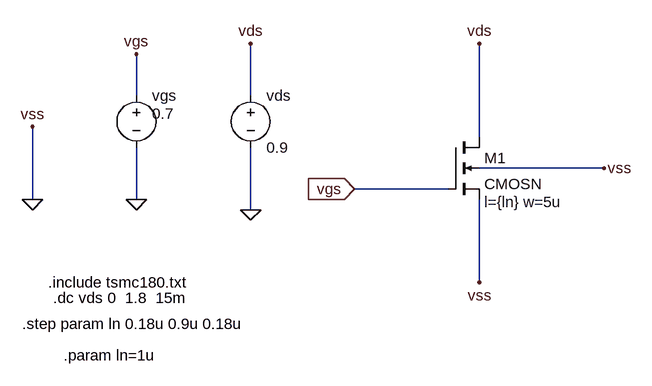
[diagram p0: schematic gmoverid.asc]
gmoverid.asc, the LTspice schematic file:
Version 4
SHEET 1 880 680
WIRE -320 32 -320 -32
WIRE -144 32 -144 -48
WIRE 208 96 208 -48
WIRE 400 144 208 144
WIRE 160 176 16 176
WIRE -480 192 -480 80
WIRE -320 192 -320 112
WIRE -144 208 -144 112
WIRE 208 320 208 192
FLAG -320 192 0
FLAG -480 192 0
FLAG -144 208 0
FLAG -480 80 vss
FLAG 400 144 vss
FLAG 208 320 vss
FLAG -320 -32 vgs
FLAG -144 -48 vds
FLAG 16 176 vgs
IOPIN 16 176 In
FLAG 208 -48 vds
SYMBOL nmos4 160 96 R0
WINDOW 123 56 100 Left 2
SYMATTR Value2 l={ln} w=5u
SYMATTR InstName M1
SYMATTR Value CMOSN
SYMBOL voltage -320 16 R0
WINDOW 3 24 44 Left 2
WINDOW 123 0 0 Left 0
WINDOW 39 0 0 Left 0
SYMATTR Value 0.7
SYMATTR InstName vgs
SYMBOL voltage -144 16 R0
WINDOW 123 0 0 Left 0
WINDOW 39 0 0 Left 0
SYMATTR InstName vds
SYMATTR Value 0.9
TEXT -456 320 Left 2 !.include tsmc180.txt
TEXT -448 344 Left 2 !.dc vds 0  1.8  15m
TEXT -496 384 Left 2 !.step param ln 0.18u 0.9u 0.18u
TEXT -432 432 Left 2 !.param ln=1u

The netlist it stands for:
* gmoverid.asc
M1 vds vgs 0 0 CMOSN l={ln} w=5u
vgs vgs 0 0.7
vds vds 0 0.9
.model NMOS NMOS
.model PMOS PMOS
.lib standard.mos
.include tsmc180.txt
.dc vds 0  1.8  15m
.step param ln 0.18u 0.9u 0.18u
.param ln=1u
.backanno
.end